# EAGLE design main35 (EAGLE 6.3)
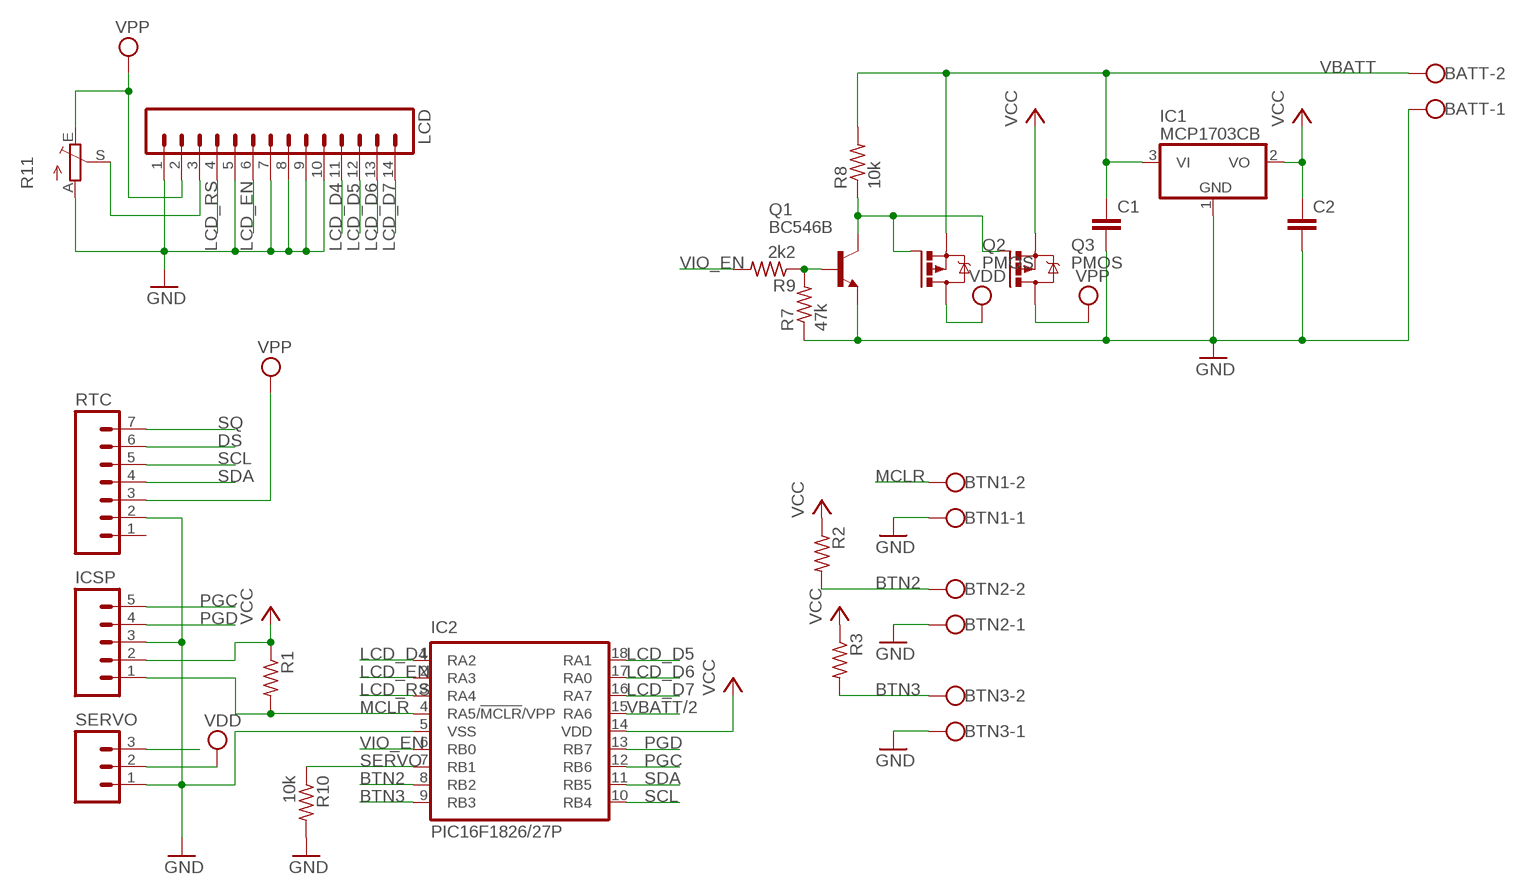
[diagram p0: schematic, sheet 1]

## Parts
BATT  W237-102  [W237-102]
BTN1  W237-102  [W237-102]
BTN2  W237-102  [W237-102]
BTN3  W237-102  [W237-102]
C1  C-EUC0805K  [C0805K]
C2  C-EUC0805K  [C0805K]
IC1  MCP1703CB  [SOT23]
IC2  PIC16F1826/27P  [DIL18]
ICSP  M05  [05P]
LCD  M14  [14P]
Q1  BC546B  [TO92-EBC]
Q2  PMOS  IRLML5203  [MICRO3]
Q3  PMOS  IRLML5203  [MICRO3]
R1  R-US_M0805  [M0805]
R2  R-US_M0805  [M0805]
R3  R-US_M0805  [M0805]
R7  47k  R-US_0207/10  [0207/10]
R8  10k  R-US_R1005  [R1005]
R9  2k2  R-US_0207/10  [0207/10]
R10  10k  R-US_R1005  [R1005]
R11  TRIM_EU-LI10  [LI10]
RTC  M07  [07P]
SERVO  M03  [03P]

## Nets
BTN2: BTN2.2 IC2.8(RB2) R2.2
BTN3: BTN3.2 IC2.9(RB3) R3.2
DS: RTC.6
GND: BATT.1 BTN1.1 BTN2.1 BTN3.1 C1.2 C2.2 IC1.1(GND) IC2.5(VSS) ICSP.3 LCD.1 LCD.5 LCD.7 LCD.8 LCD.9 LCD.10 Q1.E R7.1 R10.2 R11.A RTC.2 SERVO.1
LCD_D4: IC2.1(RA2) LCD.11
LCD_D5: IC2.18(RA1) LCD.12
LCD_D6: IC2.17(RA0) LCD.13
LCD_D7: IC2.16(RA7) LCD.14
LCD_EN: IC2.2(RA3) LCD.6
LCD_RS: IC2.3(RA4) LCD.4
MCLR: BTN1.2 IC2.4(RA5/!MCLR!/VPP) ICSP.1 R1.2
N$1: LCD.3 R11.S
N$2: Q1.B R7.2 R9.1
PGC: IC2.12(RB6) ICSP.5
PGD: IC2.13(RB7) ICSP.4
SCL: IC2.10(RB4) RTC.5
SDA: IC2.11(RB5) RTC.4
SERVO: IC2.7(RB1) R10.1 SERVO.3
SQ: RTC.7
VBATT: BATT.2 C1.1 IC1.3(VI) Q2.2(S) R8.2
VBATT/2: IC2.15(RA6)
VCC: C2.1 IC1.2(VO) IC2.14(VDD) ICSP.2 Q3.2(S) R1.1 R2.1 R3.1
VDD: Q2.3(D) SERVO.2
VGIO: Q1.C Q2.1(G) Q3.1(G) R8.1
VIO_EN: IC2.6(RB0) R9.2
VPP: LCD.2 Q3.3(D) R11.E RTC.3
Unconnected: RTC.1

## Library data of the parts
BATT BTN1-BTN3 = con-wago-500:W237-102: WAGO SCREW CLAMP; MPN: 237-102; OC_FARNELL: unknown; OC_NEWARK: 70K9898
C1 C2 = rcl:C-EU: CAPACITOR, European symbol
IC1 = linear:MCP1703: 250 mA, 16V, Low Quiescent Current LDO Regulator Source: http://ww1.microchip.com/downloads/en/DeviceDoc/22049b.pdf
IC2 = microchip:PIC16*F1826/27: 18/20/28-Pin Flash Microcontrollers with nanoWatt XLP Technology Source: www.microchip.com PIC16F1827.pdf
ICSP = con-amp-quick:M05: AMP QUICK CONNECTOR; OC_FARNELL: unknown; OC_NEWARK: unknown
LCD = con-amp-quick:M14: AMP QUICK CONNECTOR; OC_FARNELL: unknown; OC_NEWARK: unknown
Q1 = transistor-npn:BC546*: NPN Transistor
Q2 Q3 = transistor-power:IRLML5203: HEXFET P-Channel Power MOSFET
R1-R3 R7-R10 = rcl:R-US_: RESISTOR, American symbol
R11 = pot:TRIM_EU-: POTENTIOMETER
RTC = con-amp-quick:M07: AMP QUICK CONNECTOR; OC_FARNELL: unknown; OC_NEWARK: unknown
SERVO = con-amp-quick:M03: AMP QUICK CONNECTOR; OC_FARNELL: unknown; OC_NEWARK: unknown

## Board
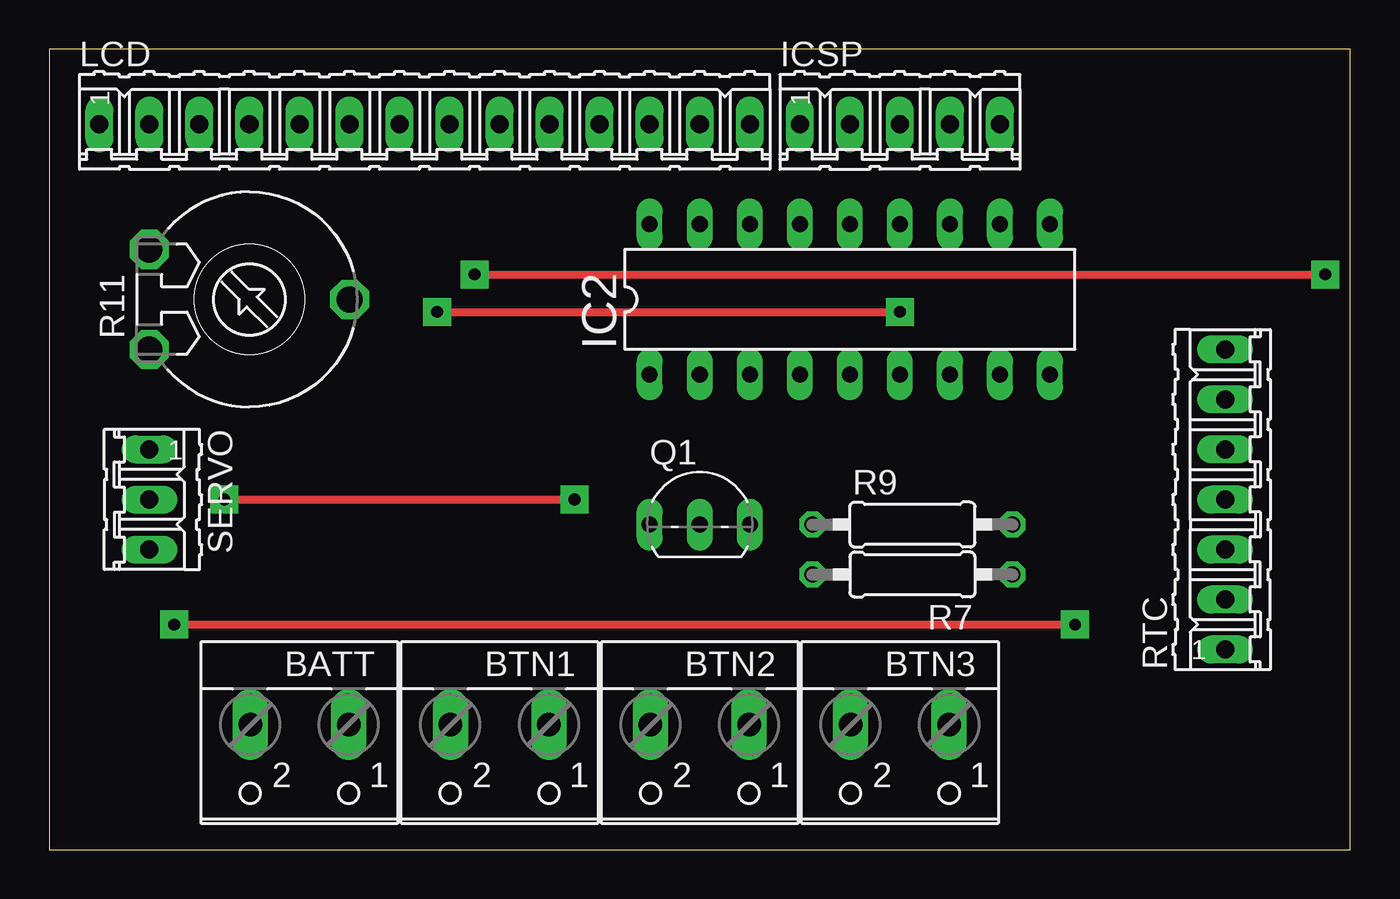
[diagram p1: board, top side]
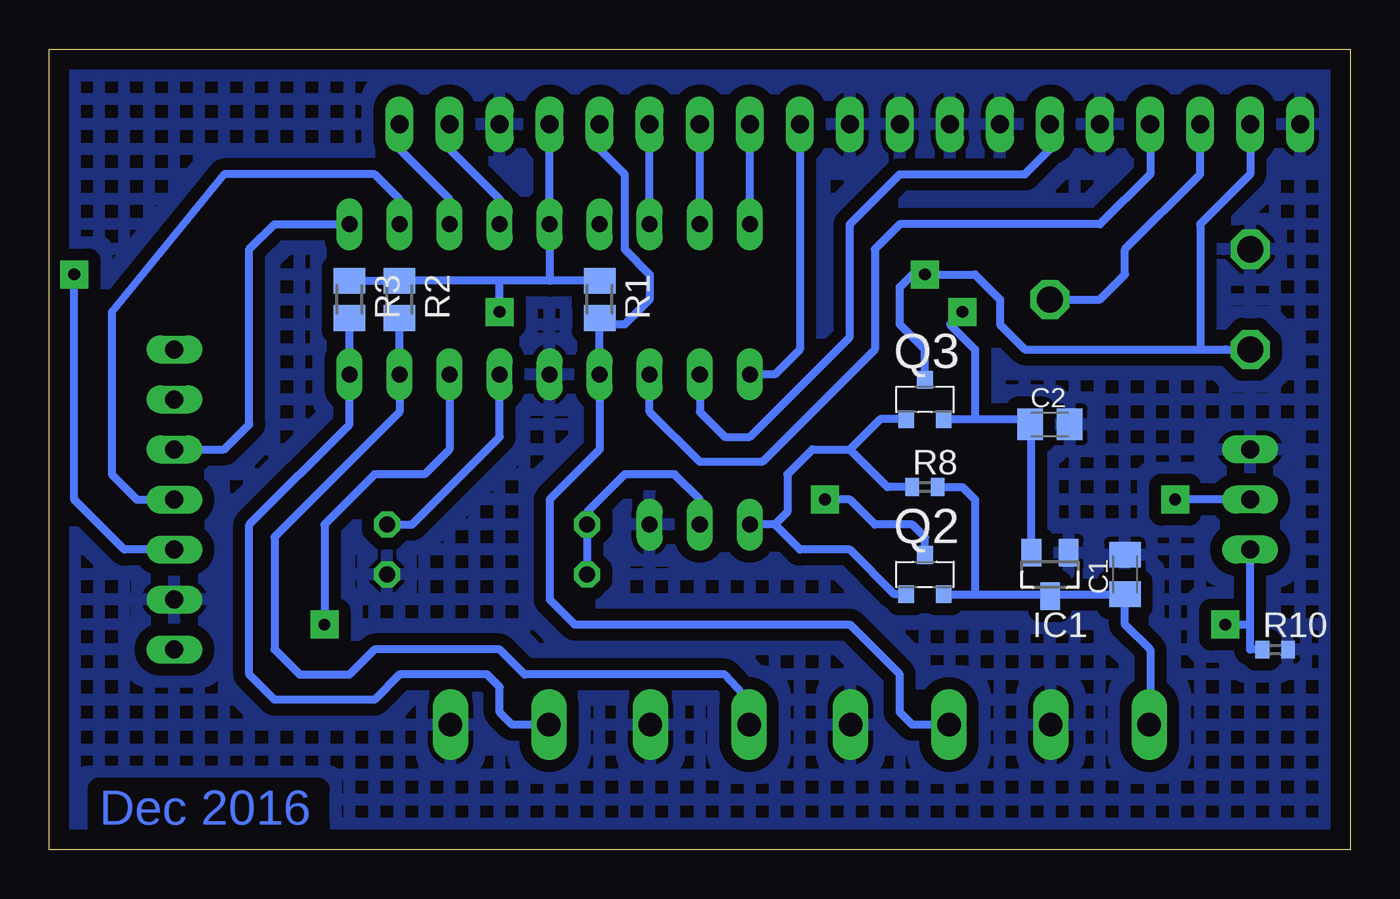
[diagram p2: board, bottom side, seen from below]

Size 66.04 x 40.64 mm. Coordinates in mm from the lower left corner, seen from the top.
Outline: 0,40.64 0,0 66.04,0 66.04,40.64 0,40.64
Copper layers (1*16): Top 0.035mm / dielectric 1.5mm / Bottom 0.035mm
Design rules "default": minimum track width 10mil, minimum drill 24mil, track to track 8mil, track to pad 8mil, pad to pad 8mil, via to via 8mil, smd to smd 8mil, copper to edge 40mil, drill to drill 8mil, minimum pad ring 10mil, minimum via ring 8mil, stop-mask expansion 4mil, vias tented up to drill 0mil, thermal gap 10mil

### Footprints (pad centres in the part's own frame; a part is rotated, then mirrored left to right if it is on the bottom)
W237-102 = drill 1.194 long: 1 -2.5,-1.27; 2 2.5,-1.27
C0805K = smd 1.3 x 1.6: 1 -1,0; 2 1,0
SOT23 = smd 1 x 1.4: 1 -0.95,-1.1; 2 0.95,-1.1; 3 0,1.1
DIL18 = drill 0.813 long: 1 -10.16,-3.81; 2 -7.62,-3.81; 3 -5.08,-3.81; 4 -2.54,-3.81; 5 0,-3.81; 6 2.54,-3.81; 7 5.08,-3.81; 8 7.62,-3.81; 9 10.16,-3.81; 10 10.16,3.81; 11 7.62,3.81; 12 5.08,3.81; 13 2.54,3.81; 14 0,3.81; 15 -2.54,3.81; 16 -5.08,3.81; 17 -7.62,3.81; 18 -10.16,3.81
05P = drill 0.914 long: 1 -5.08,0; 2 -2.54,0; 3 0,0; 4 2.54,0; 5 5.08,0
14P = drill 0.914 long: 1 -16.51,0; 2 -13.97,0; 3 -11.43,0; 4 -8.89,0; 5 -6.35,0; 6 -3.81,0; 7 -1.27,0; 8 1.27,0; 9 3.81,0; 10 6.35,0; 11 8.89,0; 12 11.43,0; 13 13.97,0; 14 16.51,0
TO92-EBC = drill 0.813 long: B 0,-1.27; C -2.54,-1.27; E 2.54,-1.27
MICRO3 = smd 0.8 x 0.9: 1 -0.95,-1; 2 0.95,-1; 3 0,1
M0805 = smd 1.3 x 1.6: 1 -0.95,0; 2 0.95,0
0207/10 = drill 0.813 octagon: 1 -5.08,0; 2 5.08,0
R1005 = smd 0.7 x 0.9: 1 -0.65,0; 2 0.65,0
LI10 = drill 1.321 octagon: A -2.54,-5.08; E 2.54,-5.08; S 0,5.08
07P = drill 0.914 long: 1 -7.62,0; 2 -5.08,0; 3 -2.54,0; 4 0,0; 5 2.54,0; 6 5.08,0; 7 7.62,0
03P = drill 0.914 long: 1 -2.54,0; 2 0,0; 3 2.54,0

### Placement (x,y rotation side)
BATT  12.7,5.08 180 top
BTN1  22.86,5.08 180 top
BTN2  33.02,5.08 180 top
BTN3  43.18,5.08 180 top
C1  11.43,13.97 90 bottom
C2  15.24,21.59 0 bottom
IC1  15.24,13.97 180 bottom
IC2  40.64,27.94 0 top
ICSP  43.18,36.83 0 top
LCD  19.05,36.83 0 top
Q1  33.02,17.78 0 top
Q2  21.59,13.97 0 bottom
Q3  21.59,22.86 0 bottom
R1  38.1,27.94 270 bottom
R2  48.26,27.94 270 bottom
R3  50.8,27.94 270 bottom
R7  43.81,13.97 180 top
R8  21.59,18.41 0 bottom
R9  43.81,16.51 0 top
R10  3.81,10.16 0 bottom
R11  10.16,27.94 270 top
RTC  59.69,17.78 90 top
SERVO  5.08,17.78 270 top

### Tracks (layer width: path | path; a pad name or v marks a point on that pad's centre or on a via)
BTN2
  Bottom 0.406: BTN2.2 30.52,7.58 31.75,8.89 41.91,8.89 43.18,10.16 49.53,10.16 50.8,8.89 53.34,8.89 54.61,10.16 54.61,15.88 48.26,22.23 IC2.8 R2.2
BTN3
  Bottom 0.406: R3.2 IC2.9 50.8,21.59 55.88,16.51 55.88,8.89 54.61,7.62 49.53,7.62 48.26,8.89 43.81,8.89 43.18,8.26 43.18,6.99 42.55,6.35 BTN3.2
GND
  pour Bottom (isolate 0.61, hatched): 64.77,0 66.04,40.64 0,40.64 0,0
LCD_D4
  Bottom 0.406: LCD.11 27.94,25.4 29.21,24.13 IC2.1
LCD_D5
  Bottom 0.406: IC2.18 LCD.12
LCD_D6
  Bottom 0.406: IC2.17 LCD.13
LCD_D7
  Bottom 0.406: IC2.16 LCD.14
LCD_EN
  Bottom 0.406: LCD.6 15.24,35.56 16.51,34.29 22.86,34.29 25.4,31.75 25.4,26.04 30.48,20.95 31.75,20.95 33.02,22.23 IC2.2
LCD_RS
  Bottom 0.406: LCD.4 10.16,34.29 12.7,31.75 22.86,31.75 24.13,30.48 24.13,25.4 29.84,19.68 33.02,19.68 35.56,22.23 IC2.3
MCLR
  Bottom 0.406: ICSP.1 38.1,35.56 36.83,34.29 36.83,30.48 35.56,29.21 35.56,27.94 36.83,26.67 37.78,26.67 R1.2 IC2.4 38.1,20.32 40.64,17.78 40.64,12.7 39.37,11.43 25.4,11.43 22.86,8.89 22.86,6.99 22.23,6.35 BTN1.2
N$1
  Bottom 0.406: R11.S 12.7,27.94 11.43,29.21 11.43,30.48 7.62,34.29 LCD.3
N$2
  Bottom 0.406: R7.2 R9.1 38.73,17.14 36.83,19.05 34.29,19.05 33.02,17.78 Q1.B
PGC
  Bottom 0.406: IC2.12 45.72,33.02 48.26,35.56 ICSP.5
PGD
  Bottom 0.406: IC2.13 43.18,33.02 45.72,35.56 ICSP.4
SCL
  Bottom 0.406: RTC.5 57.15,20.32 55.88,21.59 55.88,30.48 54.61,31.75 IC2.10
SDA
  Bottom 0.406: IC2.11 48.26,33.02 49.53,34.29 57.15,34.29 62.87,27.3 62.87,19.05 61.59,17.78 RTC.4
SERVO  (via drill 0.6 pad 1.42)
  Top 0.406: v6.35,11.43 v52.07,11.43
  Bottom 0.406: 5.08,11.43 5.08,10.16 R10.1 | 5.08,11.43 SERVO.3 | IC2.7 45.72,20.32 46.99,19.05 49.53,19.05 52.07,16.51 v52.07,11.43 | v6.35,11.43 5.08,11.43
VBATT
  Bottom 0.406: Q2.2 19.05,12.97 | 19.05,12.97 15.24,12.97 | 10.16,6.35 10.16,10.16 11.43,11.43 C1.1 15.24,12.97 | 10.16,6.35 10.16,5.12 BATT.2 10.16,6.35 | IC1.3 15.24,12.97 | R8.2 19.68,18.41 19.05,17.78 19.05,12.97
VCC  (via drill 0.6 pad 1.42)
  Top 0.406: v19.68,27.3 v43.18,27.3
  Bottom 0.406: ICSP.2 IC2.14 40.64,28.89 | IC1.2 16.19,21.54 C2.1 16.51,21.86 19.05,21.86 | Q3.2 19.05,21.86 | v19.68,27.3 20.32,26.67 19.05,25.4 19.05,21.86 | R3.1 R2.1 43.18,28.89 | R1.1 40.64,28.89 | 40.64,28.89 43.18,28.89 | v43.18,27.3 43.18,28.89
VDD  (via drill 0.6 pad 1.42)
  Top 0.406: v8.89,17.78 v26.67,17.78
  Bottom 0.406: Q2.3 21.59,15.88 22.23,16.51 24.13,16.51 25.4,17.78 v26.67,17.78 | SERVO.2 v8.89,17.78
VGIO
  Bottom 0.406: 25.4,20.32 23.5,18.41 R8.1 | 25.4,20.32 23.86,21.86 Q3.1 | 25.4,20.32 27.3,20.32 28.57,19.05 28.57,17.14 29.21,16.51 | 29.21,16.51 Q1.C | Q2.1 23.13,12.97 25.4,15.24 27.94,15.24 29.21,16.51
VIO_EN
  Bottom 0.406: R9.2 47.62,16.51 43.18,20.95 IC2.6
VPP  (via drill 0.6 pad 1.42)
  Top 0.406: v21.59,29.21 v64.77,29.21
  Bottom 0.406: LCD.2 5.08,34.29 7.62,31.75 7.62,25.4 | 6.35,25.4 R11.E 7.62,25.4 | Q3.3 21.59,25.4 22.86,26.67 22.86,28.57 22.23,29.21 v21.59,29.21 19.05,29.21 17.78,27.94 17.78,26.67 16.51,25.4 7.62,25.4 | RTC.3 62.23,15.24 64.77,17.78 v64.77,29.21

### Text on the board
Bottom: Dec 2016